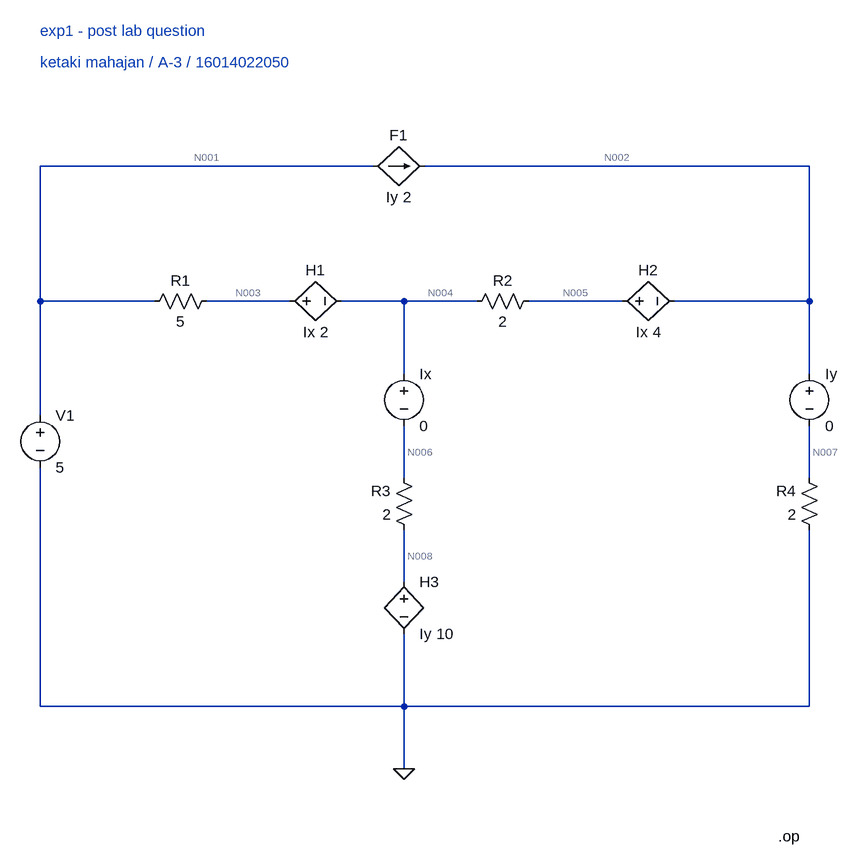
[diagram p0: schematic exp1_plq.asc]
exp1_plq.asc, the LTspice schematic file:
Version 4
SHEET 1 1080 936
WIRE 352 -112 -160 -112
WIRE 1024 -112 432 -112
WIRE -160 96 -160 -112
WIRE 16 96 -160 96
WIRE 224 96 96 96
WIRE 400 96 304 96
WIRE 512 96 400 96
WIRE 736 96 592 96
WIRE 1024 96 1024 -112
WIRE 1024 96 816 96
WIRE 400 208 400 96
WIRE 1024 208 1024 96
WIRE -160 272 -160 96
WIRE 400 368 400 288
WIRE 1024 368 1024 288
WIRE 400 528 400 448
WIRE -160 720 -160 352
WIRE 400 720 400 608
WIRE 400 720 -160 720
WIRE 1024 720 1024 448
WIRE 1024 720 400 720
WIRE 400 816 400 720
FLAG 400 816 0
SYMBOL res 112 80 R90
WINDOW 0 0 56 VBottom 2
WINDOW 3 32 56 VTop 2
SYMATTR InstName R1
SYMATTR Value 5
SYMBOL res 608 80 R90
WINDOW 0 0 56 VBottom 2
WINDOW 3 32 56 VTop 2
SYMATTR InstName R2
SYMATTR Value 2
SYMBOL res 416 464 R180
WINDOW 0 36 76 Left 2
WINDOW 3 36 40 Left 2
SYMATTR InstName R3
SYMATTR Value 2
SYMBOL res 1040 464 R180
WINDOW 0 36 76 Left 2
WINDOW 3 36 40 Left 2
SYMATTR InstName R4
SYMATTR Value 2
SYMBOL h 208 96 R270
WINDOW 0 32 56 VTop 2
WINDOW 3 -32 56 VBottom 2
SYMATTR InstName H1
SYMATTR Value Ix 2
SYMBOL h 720 96 R270
WINDOW 0 32 56 VTop 2
WINDOW 3 -32 56 VBottom 2
SYMATTR InstName H2
SYMATTR Value Ix 4
SYMBOL f 352 -112 R270
WINDOW 0 32 40 VTop 2
WINDOW 3 -32 40 VBottom 2
SYMATTR InstName F1
SYMATTR Value Iy 2
SYMBOL voltage 400 192 R0
SYMATTR InstName Ix
SYMATTR Value 0
SYMBOL voltage -160 256 R0
WINDOW 123 0 0 Left 0
WINDOW 39 0 0 Left 0
SYMATTR InstName V1
SYMATTR Value 5
SYMBOL voltage 1024 192 R0
WINDOW 123 0 0 Left 0
WINDOW 39 0 0 Left 0
SYMATTR InstName Iy
SYMATTR Value 0
SYMBOL h 400 512 R0
SYMATTR InstName H3
SYMATTR Value Iy 10
TEXT -160 -320 Left 2 ;exp1 - post lab question
TEXT -160 -272 Left 2 ;ketaki mahajan / A-3 / 16014022050
TEXT 976 920 Left 2 !.op

The netlist it stands for:
* exp1_plq.asc
R1 N003 N001 5
R2 N005 N004 2
R3 N008 N006 2
R4 0 N007 2
H1 N003 N004 Ix 2
H2 N005 N002 Ix 4
F1 N001 N002 Iy 2
V§Ix N004 N006 0
V1 N001 0 5
V§Iy N002 N007 0
H3 N008 0 Iy 10
* exp1 - post lab question
* ketaki mahajan / A-3 / 16014022050
.op
.backanno
.end

* Results of the author's LTspice run, read from the files saved beside the schematic
* Operating Point:
*   V(n003) = 3 V
*   V(n001) = 5 V
*   V(n005) = 2.2 V
*   V(n004) = 2 V
*   V(n008) = 1 V
*   V(n006) = 2 V
*   V(n007) = 200 mV
*   V(n002) = 200 mV
*   I(F1) = 200 mA
*   I(H1) = 400 mA
*   I(H2) = -100 mA
*   I(H3) = 500 mA
*   I(R1) = -400 mA
*   I(R2) = 100 mA
*   I(R3) = -500 mA
*   I(R4) = -100 mA
*   I(Ix) = 500 mA
*   I(V1) = -600 mA
*   I(Iy) = 100 mA